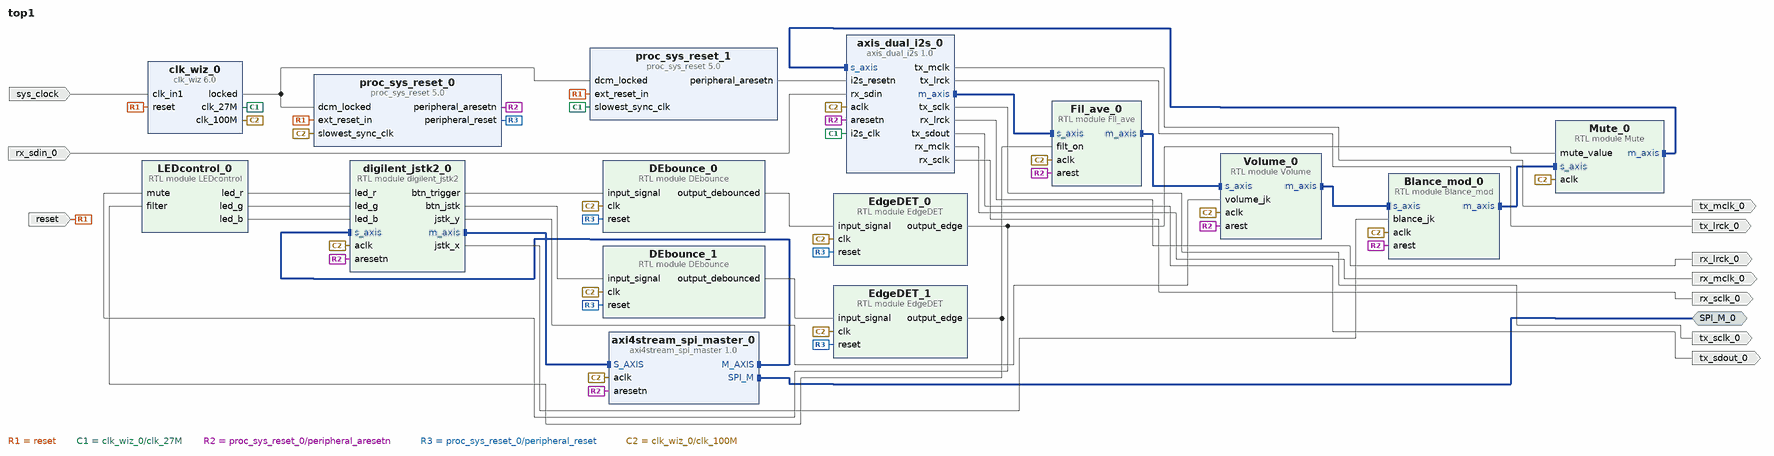
[diagram p0: block diagram of the top level]
# Vivado block design top1, xc7a35tcpg236-1, Vivado 2020.2
create_bd_design top1

create_bd_intf_port -mode Master -vlnv xilinx.com:interface:spi_rtl:1.0 SPI_M_0
create_bd_port -dir I -type clk sys_clock
set_property -dict {CONFIG.FREQ_HZ 100000000 CONFIG.PHASE 0.000} [get_bd_ports sys_clock]
create_bd_port -dir I -type rst reset
set_property -dict {CONFIG.POLARITY ACTIVE_HIGH} [get_bd_ports reset]
create_bd_port -dir I rx_sdin_0
create_bd_port -dir O tx_mclk_0
create_bd_port -dir O tx_lrck_0
create_bd_port -dir O tx_sclk_0
create_bd_port -dir O tx_sdout_0
create_bd_port -dir O rx_mclk_0
create_bd_port -dir O rx_lrck_0
create_bd_port -dir O rx_sclk_0

create_bd_cell -type ip -vlnv xilinx.com:ip:clk_wiz:6.0 clk_wiz_0
set_property -dict [list \
  CONFIG.CLKOUT1_JITTER 149.337 \
  CONFIG.CLKOUT1_PHASE_ERROR 122.577 \
  CONFIG.CLKOUT2_JITTER 201.826 \
  CONFIG.CLKOUT2_PHASE_ERROR 122.577 \
  CONFIG.CLKOUT2_REQUESTED_OUT_FREQ 22.579 \
  CONFIG.CLKOUT2_USED true \
  CONFIG.CLK_IN1_BOARD_INTERFACE sys_clock \
  CONFIG.CLK_OUT1_PORT clk_100M \
  CONFIG.CLK_OUT2_PORT clk_27M \
  CONFIG.MMCM_CLKFBOUT_MULT_F 7.000 \
  CONFIG.MMCM_CLKOUT0_DIVIDE_F 7.000 \
  CONFIG.MMCM_CLKOUT1_DIVIDE 31 \
  CONFIG.NUM_OUT_CLKS 2 \
  CONFIG.RESET_BOARD_INTERFACE reset \
  CONFIG.USE_BOARD_FLOW true \
] [get_bd_cells clk_wiz_0]
create_bd_cell -type ip -vlnv xilinx.com:ip:proc_sys_reset:5.0 proc_sys_reset_0
create_bd_cell -type ip -vlnv xilinx.com:ip:proc_sys_reset:5.0 proc_sys_reset_1
create_bd_cell -type module -reference digilent_jstk2 digilent_jstk2_0
create_bd_cell -type ip -vlnv DigiLAB:ip:axi4stream_spi_master:1.0 axi4stream_spi_master_0
set_property -dict {CONFIG.c_sclkfreq 5000} [get_bd_cells axi4stream_spi_master_0]
create_bd_cell -type ip -vlnv DigiLAB:ip:axis_dual_i2s:1.0 axis_dual_i2s_0
create_bd_cell -type module -reference DEbounce DEbounce_0
create_bd_cell -type module -reference DEbounce DEbounce_1
create_bd_cell -type module -reference EdgeDET EdgeDET_0
create_bd_cell -type module -reference EdgeDET EdgeDET_1
create_bd_cell -type module -reference LEDcontrol LEDcontrol_0
create_bd_cell -type module -reference Mute Mute_0
create_bd_cell -type module -reference Fil_ave Fil_ave_0
create_bd_cell -type module -reference Volume Volume_0
create_bd_cell -type module -reference Blance_mod Blance_mod_0

# ---- connections ----

connect_bd_intf_net [get_bd_intf_pins digilent_jstk2_0/m_axis] [get_bd_intf_pins axi4stream_spi_master_0/S_AXIS]
connect_bd_intf_net [get_bd_intf_pins axis_dual_i2s_0/m_axis] [get_bd_intf_pins Fil_ave_0/s_axis]
connect_bd_intf_net [get_bd_intf_ports SPI_M_0] [get_bd_intf_pins axi4stream_spi_master_0/SPI_M]
connect_bd_intf_net [get_bd_intf_pins Volume_0/s_axis] [get_bd_intf_pins Fil_ave_0/m_axis]
connect_bd_intf_net [get_bd_intf_pins axi4stream_spi_master_0/M_AXIS] [get_bd_intf_pins digilent_jstk2_0/s_axis]
connect_bd_intf_net [get_bd_intf_pins Mute_0/m_axis] [get_bd_intf_pins axis_dual_i2s_0/s_axis]
connect_bd_intf_net [get_bd_intf_pins Mute_0/s_axis] [get_bd_intf_pins Blance_mod_0/m_axis]
connect_bd_intf_net [get_bd_intf_pins Blance_mod_0/s_axis] [get_bd_intf_pins Volume_0/m_axis]
connect_bd_net [get_bd_ports sys_clock] [get_bd_pins clk_wiz_0/clk_in1]
connect_bd_net [get_bd_ports reset] \
  [get_bd_pins clk_wiz_0/reset] [get_bd_pins proc_sys_reset_0/ext_reset_in] [get_bd_pins proc_sys_reset_1/ext_reset_in]
connect_bd_net [get_bd_pins clk_wiz_0/locked] [get_bd_pins proc_sys_reset_0/dcm_locked] [get_bd_pins proc_sys_reset_1/dcm_locked]
connect_bd_net [get_bd_pins clk_wiz_0/clk_27M] [get_bd_pins proc_sys_reset_1/slowest_sync_clk] [get_bd_pins axis_dual_i2s_0/i2s_clk]
connect_bd_net [get_bd_pins proc_sys_reset_0/peripheral_aresetn] \
  [get_bd_pins digilent_jstk2_0/aresetn] [get_bd_pins axi4stream_spi_master_0/aresetn] [get_bd_pins axis_dual_i2s_0/aresetn] \
  [get_bd_pins Fil_ave_0/arest] [get_bd_pins Volume_0/arest] [get_bd_pins Blance_mod_0/arest]
connect_bd_net [get_bd_pins proc_sys_reset_0/peripheral_reset] \
  [get_bd_pins DEbounce_0/reset] [get_bd_pins DEbounce_1/reset] [get_bd_pins EdgeDET_0/reset] [get_bd_pins EdgeDET_1/reset]
connect_bd_net [get_bd_pins digilent_jstk2_0/btn_trigger] [get_bd_pins DEbounce_0/input_signal]
connect_bd_net [get_bd_pins DEbounce_0/output_debounced] [get_bd_pins EdgeDET_0/input_signal]
connect_bd_net [get_bd_pins EdgeDET_0/output_edge] [get_bd_pins LEDcontrol_0/mute] [get_bd_pins Mute_0/mute_value]
connect_bd_net [get_bd_pins digilent_jstk2_0/btn_jstk] [get_bd_pins DEbounce_1/input_signal]
connect_bd_net [get_bd_pins DEbounce_1/output_debounced] [get_bd_pins EdgeDET_1/input_signal]
connect_bd_net [get_bd_pins EdgeDET_1/output_edge] [get_bd_pins LEDcontrol_0/filter] [get_bd_pins Fil_ave_0/filt_on]
connect_bd_net [get_bd_pins LEDcontrol_0/led_r] [get_bd_pins digilent_jstk2_0/led_r]
connect_bd_net [get_bd_pins LEDcontrol_0/led_g] [get_bd_pins digilent_jstk2_0/led_g]
connect_bd_net [get_bd_pins LEDcontrol_0/led_b] [get_bd_pins digilent_jstk2_0/led_b]
connect_bd_net -net rx_sdin_0_1 [get_bd_ports rx_sdin_0] [get_bd_pins axis_dual_i2s_0/rx_sdin]
connect_bd_net [get_bd_pins proc_sys_reset_1/peripheral_aresetn] [get_bd_pins axis_dual_i2s_0/i2s_resetn]
connect_bd_net [get_bd_pins axis_dual_i2s_0/tx_mclk] [get_bd_ports tx_mclk_0]
connect_bd_net [get_bd_pins axis_dual_i2s_0/tx_lrck] [get_bd_ports tx_lrck_0]
connect_bd_net [get_bd_pins axis_dual_i2s_0/tx_sclk] [get_bd_ports tx_sclk_0]
connect_bd_net [get_bd_pins axis_dual_i2s_0/tx_sdout] [get_bd_ports tx_sdout_0]
connect_bd_net [get_bd_pins axis_dual_i2s_0/rx_mclk] [get_bd_ports rx_mclk_0]
connect_bd_net [get_bd_pins axis_dual_i2s_0/rx_lrck] [get_bd_ports rx_lrck_0]
connect_bd_net [get_bd_pins axis_dual_i2s_0/rx_sclk] [get_bd_ports rx_sclk_0]
connect_bd_net [get_bd_pins clk_wiz_0/clk_100M] \
  [get_bd_pins proc_sys_reset_0/slowest_sync_clk] [get_bd_pins digilent_jstk2_0/aclk] \
  [get_bd_pins axi4stream_spi_master_0/aclk] [get_bd_pins axis_dual_i2s_0/aclk] [get_bd_pins DEbounce_0/clk] \
  [get_bd_pins DEbounce_1/clk] [get_bd_pins EdgeDET_0/clk] [get_bd_pins EdgeDET_1/clk] [get_bd_pins Mute_0/aclk] \
  [get_bd_pins Fil_ave_0/aclk] [get_bd_pins Volume_0/aclk] [get_bd_pins Blance_mod_0/aclk]
connect_bd_net [get_bd_pins digilent_jstk2_0/jstk_y] [get_bd_pins Volume_0/volume_jk]
connect_bd_net [get_bd_pins digilent_jstk2_0/jstk_x] [get_bd_pins Blance_mod_0/blance_jk]

validate_bd_design
save_bd_design
